# EAGLE design pwm-inverter (EAGLE 7.7.0)

## Sheet 1 of 2
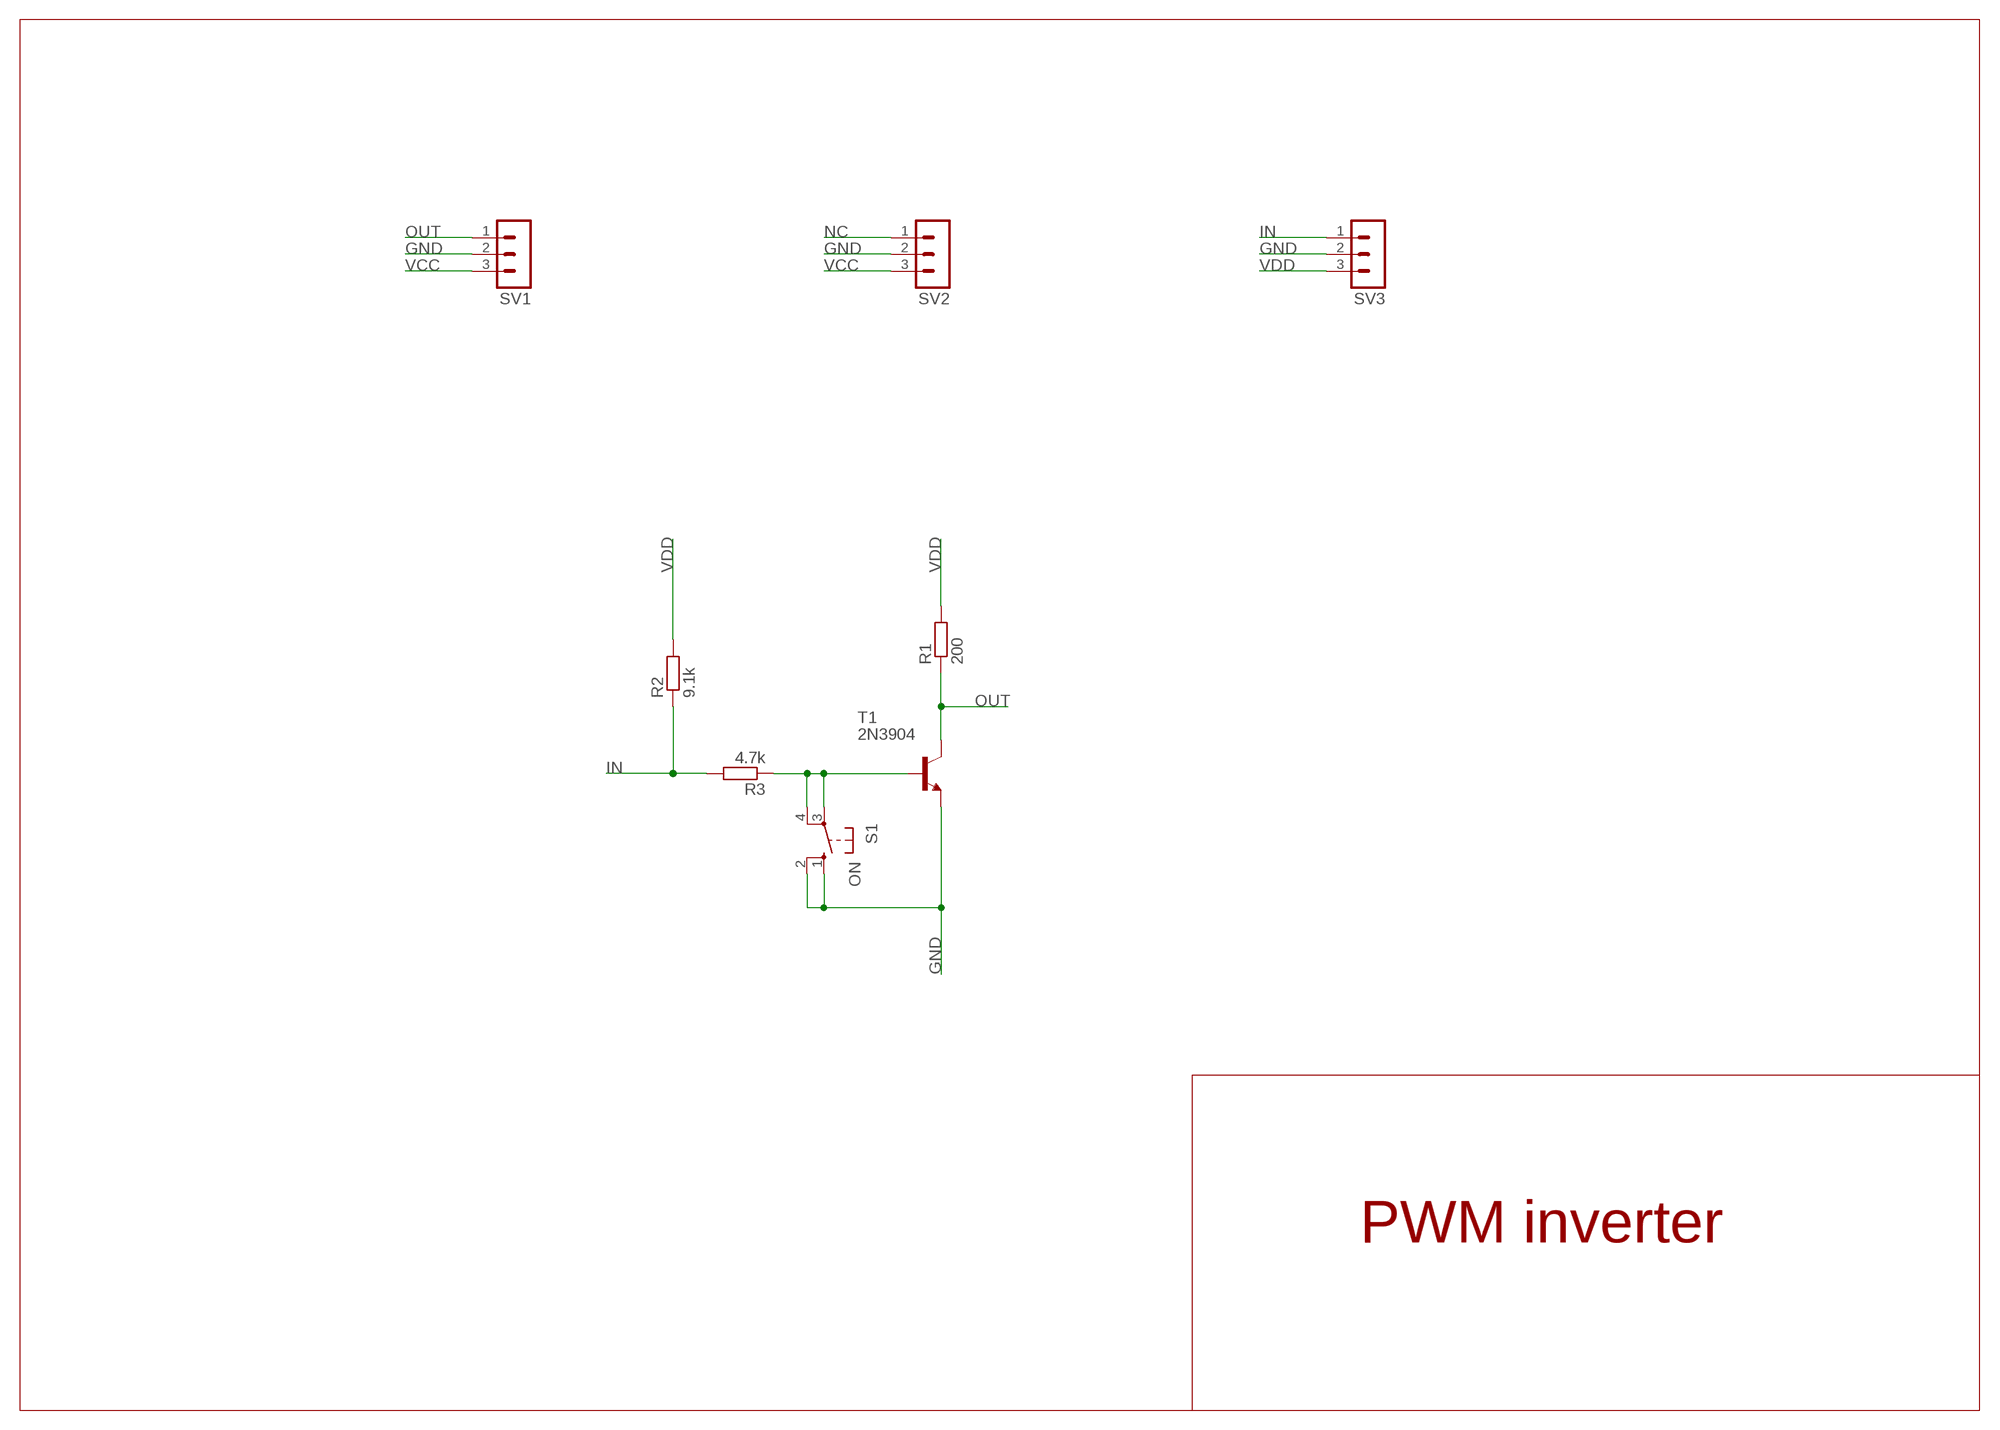
[diagram p0: schematic, sheet 1]

### Parts
R1  200  R-EU_0207/10  [0207/10]
R2  9.1k  R-EU_0207/10  [0207/10]
R3  4.7k  R-EU_0207/10  [0207/10]
S1  ON  10-XX  [B3F-10XX]
SV1  MA03-1  [MA03-1]
SV2  MA03-1  [MA03-1]
SV3  MA03-1  [MA03-1]
T1  2N3904  [TO92]

### Nets
GND: S1.1(S) S1.2(S1) SV1.2 SV2.2 SV3.2 T1.3(E)
IN: R2.1 R3.2 SV3.1
N$3: R3.1 S1.3(P) S1.4(P1) T1.2(B)
NC: SV2.1
OUT: R1.1 SV1.1 T1.1(C)
VCC: SV1.3 SV2.3
VDD: R1.2 R2.2 SV3.3

### Notes on the sheet
- PWM inverter

## Sheet 2 of 2
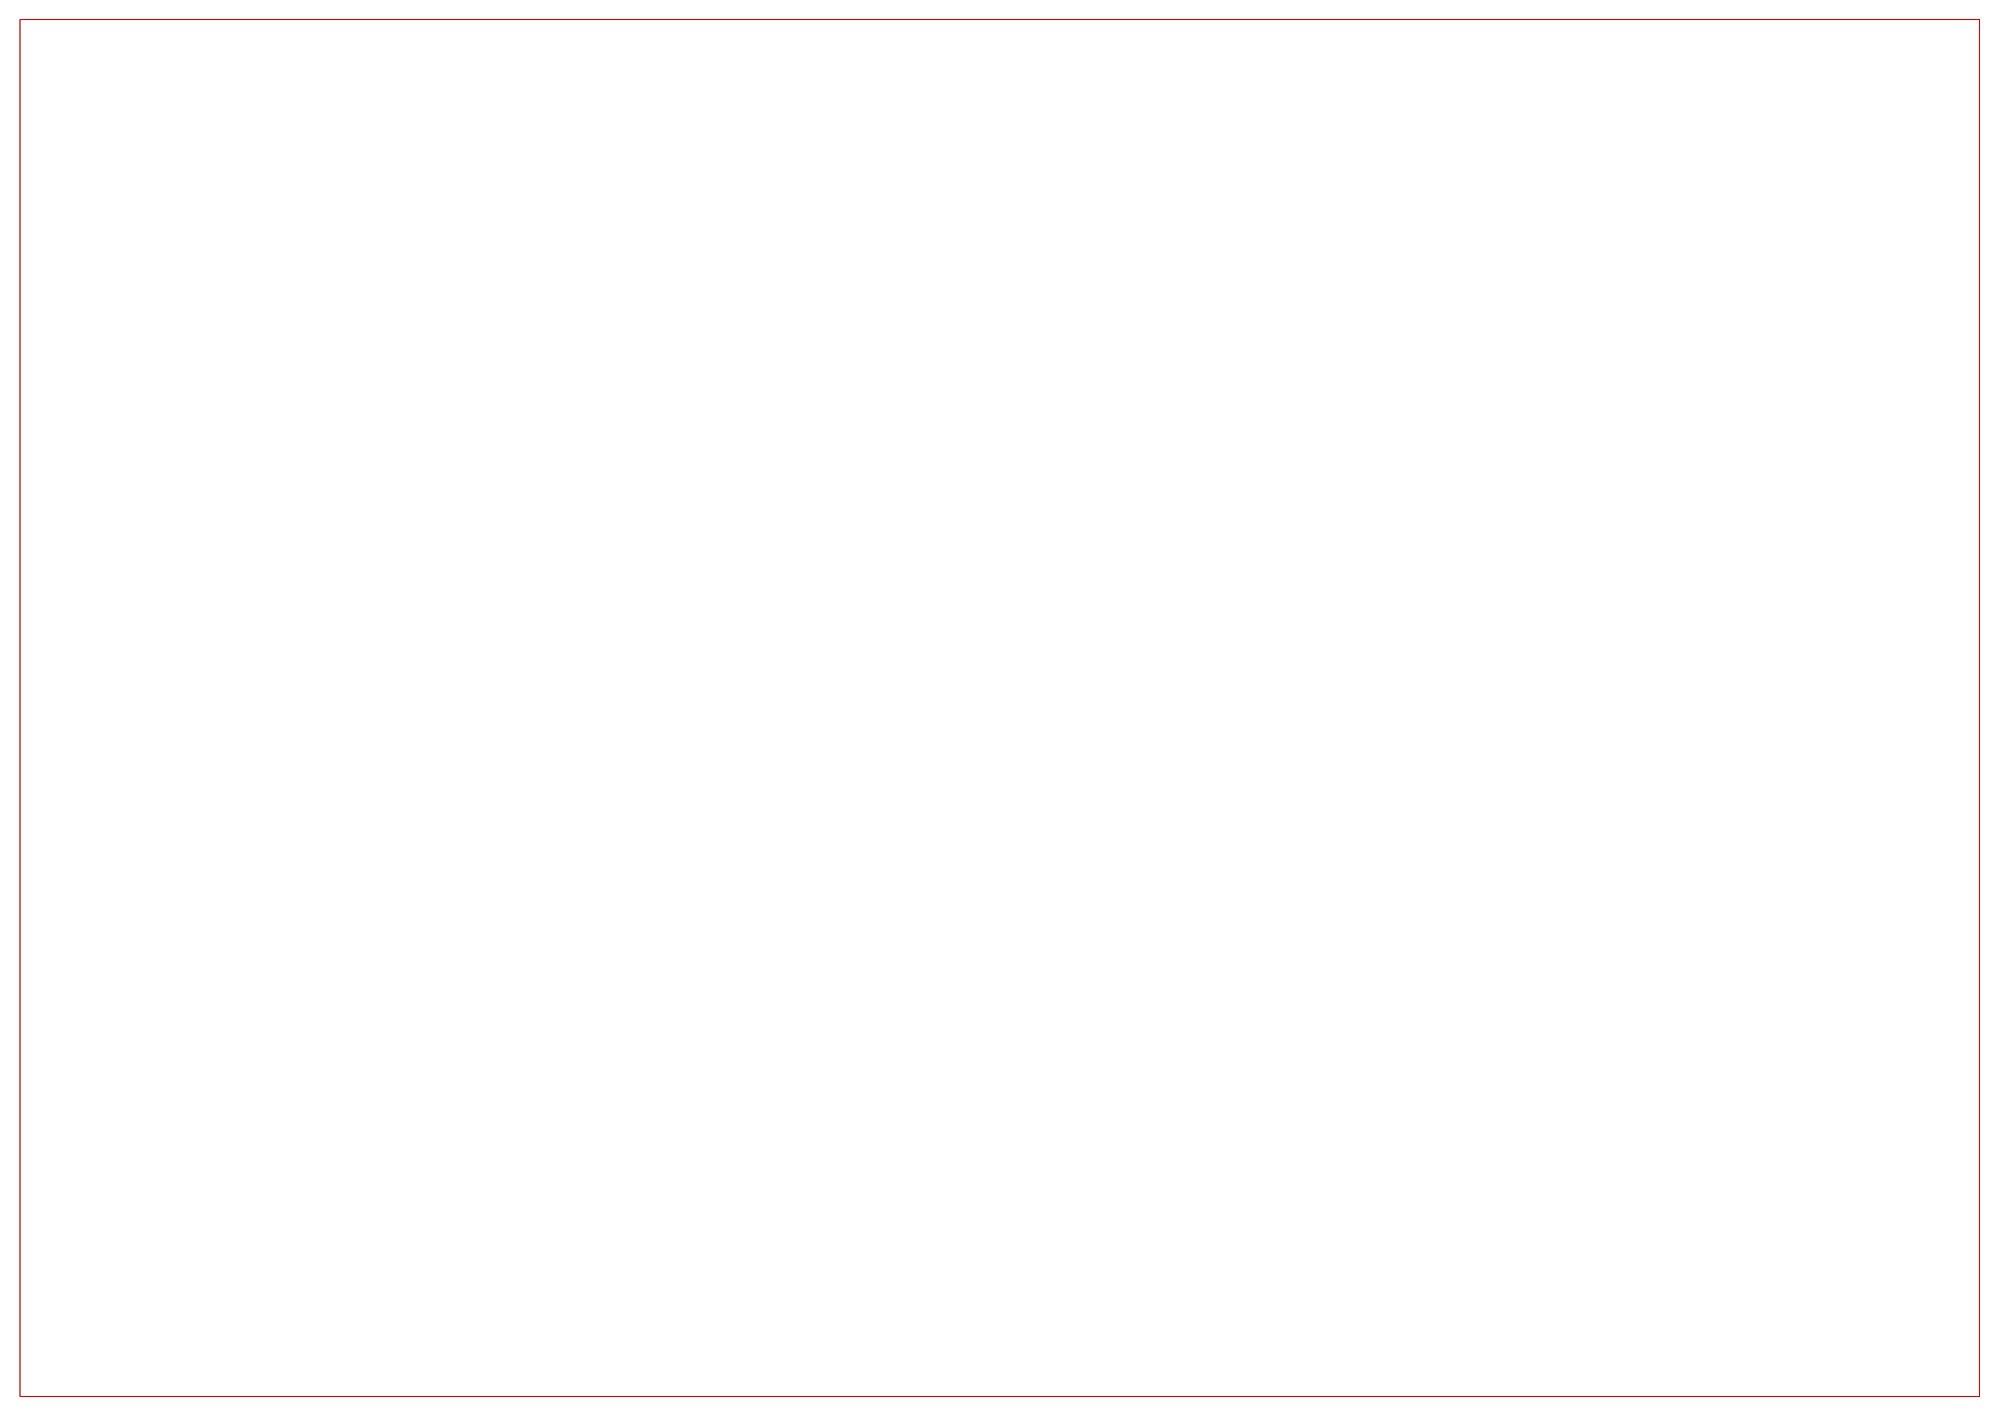
[diagram p1: schematic, sheet 2]

## Library data of the parts
R1-R3 = rcl:R-EU_: RESISTOR, European symbol
S1 = switch-omron:10-XX: OMRON SWITCH; MPN: B3F-1000; OC_FARNELL: 176432; OC_NEWARK: 36M3542
SV1-SV3 = con-lstb:MA03-1: PIN HEADER; OC_FARNELL: unknown; OC_NEWARK: unknown
T1 = transistor:2N3904: NPN TRANSISTOR

## Board
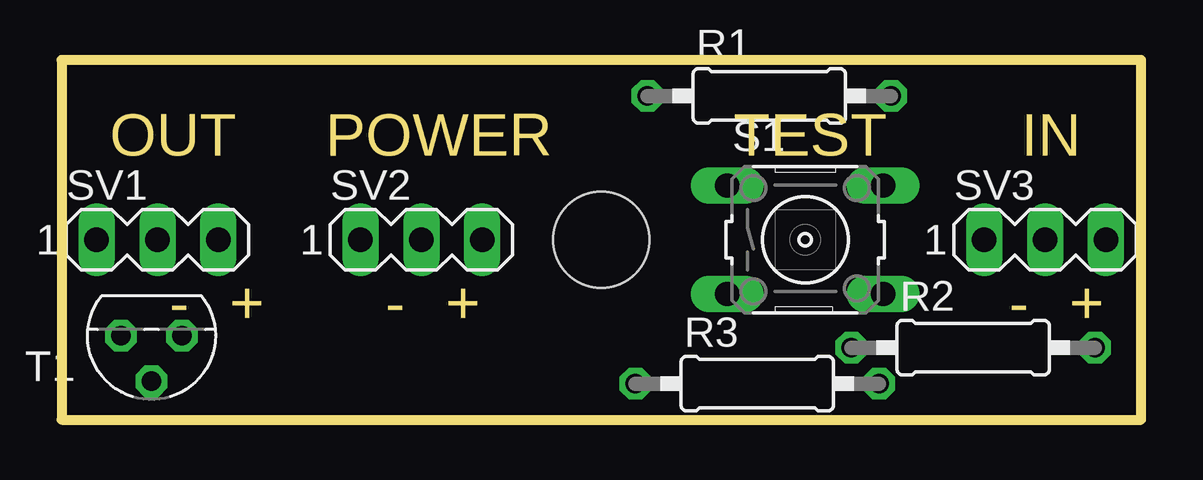
[diagram p2: board, top side]
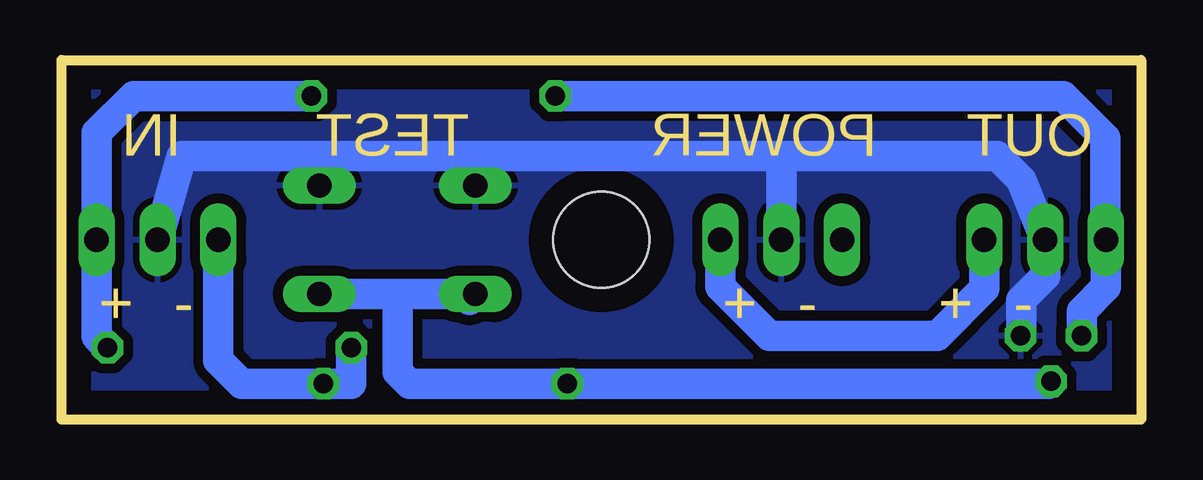
[diagram p3: board, bottom side, seen from below]

Size 45 x 15 mm. Coordinates in mm from the lower left corner, seen from the top.
Outline: 0,0 45,0 45,15 0,15 0,0
Copper layers (1*16): Top 0.035mm / dielectric 1.5mm / Bottom 0.035mm
Design rules "default": minimum track width 10mil, minimum drill 24mil, track to track 8mil, track to pad 8mil, pad to pad 8mil, via to via 8mil, smd to smd 8mil, copper to edge 40mil, drill to drill 8mil, minimum pad ring 10mil, minimum via ring 8mil, stop-mask expansion 4mil, vias tented up to drill 0mil, thermal gap 10mil
Holes 4 mm at 22.5,7.5
tKeepout: area 18.8,3.8 to 26.2,11.2

### Footprints (pad centres in the part's own frame; a part is rotated, then mirrored left to right if it is on the bottom)
0207/10 = drill 0.813 octagon: 1 -5.08,0; 2 5.08,0
B3F-10XX = drill 1.016 long: 1 -3.251,2.261; 2 3.251,2.261; 3 -3.251,-2.261; 4 3.251,-2.261
MA03-1 = drill 1.016 long: 1 -2.54,0; 2 0,0; 3 2.54,0
TO92 = drill 0.813 octagon: 1 1.27,0; 2 0,1.905; 3 -1.27,0

### Placement (x,y rotation side)
R1  29.5,13.5 0 top
R2  38,3 0 top
R3  29,1.5 0 top
S1  31,7.5 0 top
SV1  4,7.5 0 top
SV2  15,7.5 0 top
SV3  41,7.5 0 top
T1  3.75,3.5 180 top

### Tracks (layer width: path | path; a pad name or v marks a point on that pad's centre or on a via)
GND
  Bottom 1.27: T1.3 5,3.5 5,5 4,6 4,7 | SV1.2 5,10 6,11 15,11 | 15,11 28,11 | 28,11 34,11 | 34,11 40,11 SV3.2 | S1.1 27.75,10.75 28,11 | S1.2 34.25,10.75 34,11 | SV2.2 15,11
  pour Bottom (isolate 0.406): 0,15 0,0 45,0 45,15
IN
  Bottom 1.27: R2.1 32.92,1.5 R3.2 37.5,1.5 38.46,2.46 SV3.1
N$3
  Bottom 1.27: 28,4.99 S1.3 31,5.24 | T1.2 3.85,1.5 R3.1 30.5,1.5 31,2 31,5.24 | S1.4 31,5.24
OUT
  Bottom 1.27: 2.46,3.75 T1.1 2.48,4.52 1.46,5.54 SV1.1 1.5,7.54 1.5,11.75 3.25,13.5 R1.1
VCC
  Bottom 1.27: SV1.3 6.54,5.46 8.5,3.5 15.5,3.5 17.54,5.54 SV2.3
VDD
  Bottom 1.27: R1.2 42,13.5 43.54,11.96 SV3.3 43.54,3.46 R2.2

### Text on the board
Milling: OUT | POWER | TEST | IN | - | + | - | + | - | +